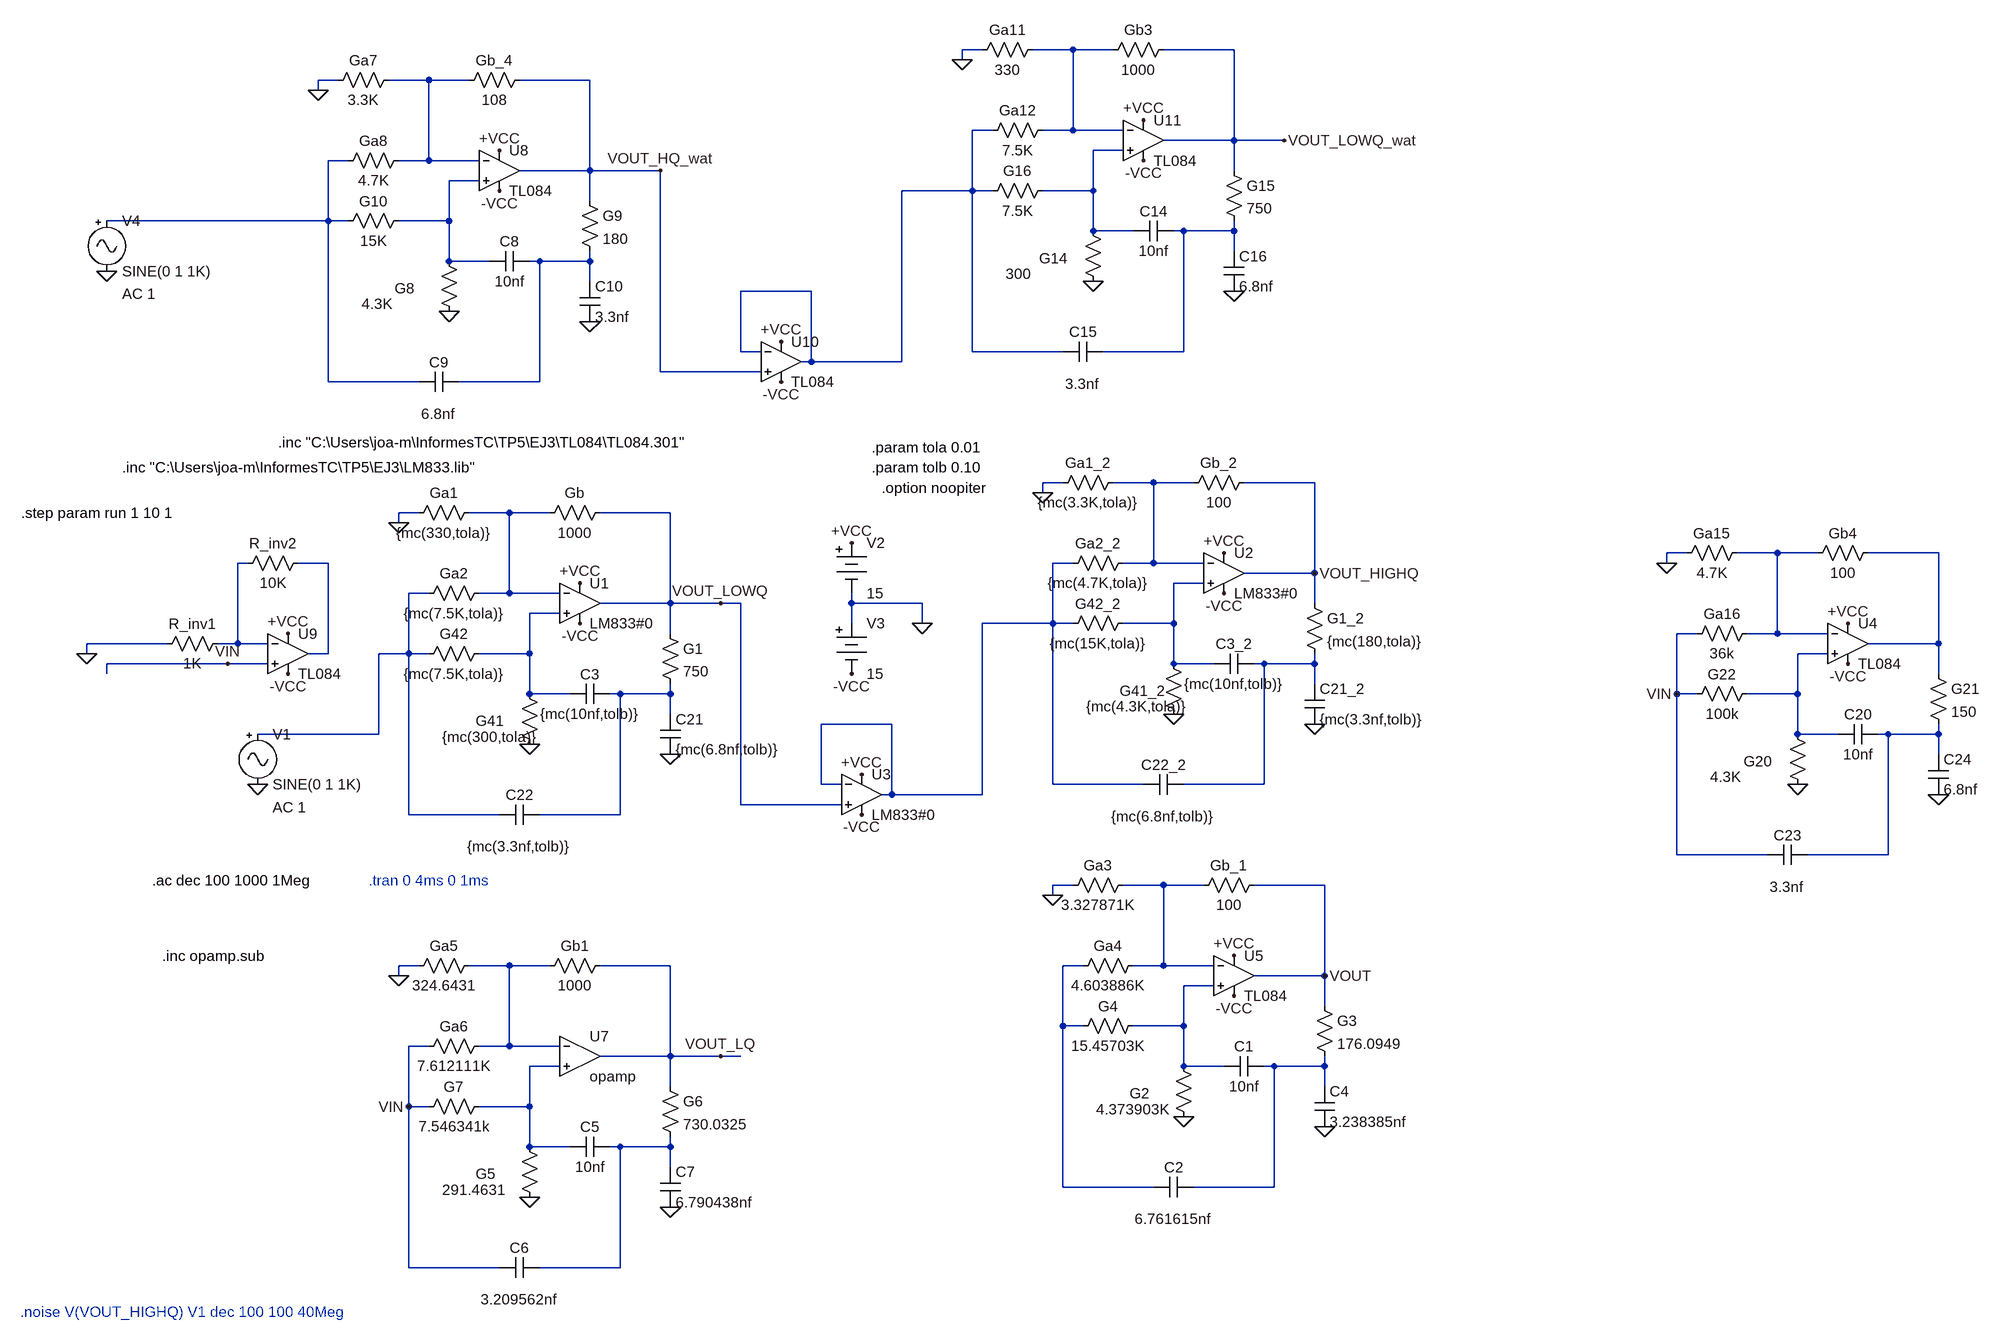
[diagram p0: schematic SedraConPablomenos05.asc]
SedraConPablomenos05.asc, the LTspice schematic file:
Version 4
SHEET 1 3008 2004
WIRE 1040 -736 1008 -736
WIRE 1184 -736 1120 -736
WIRE 1248 -736 1184 -736
WIRE 1440 -736 1328 -736
WIRE 1008 -720 1008 -736
WIRE 16 -688 -16 -688
WIRE 160 -688 96 -688
WIRE 224 -688 160 -688
WIRE 416 -688 304 -688
WIRE -16 -672 -16 -688
WIRE 1056 -608 1024 -608
WIRE 1184 -608 1184 -736
WIRE 1184 -608 1136 -608
WIRE 1264 -608 1184 -608
WIRE 1440 -592 1440 -736
WIRE 1440 -592 1328 -592
WIRE 1520 -592 1440 -592
WIRE 1264 -576 1216 -576
WIRE 32 -560 0 -560
WIRE 160 -560 160 -688
WIRE 160 -560 112 -560
WIRE 240 -560 160 -560
WIRE 416 -544 416 -688
WIRE 416 -544 304 -544
WIRE 528 -544 416 -544
WIRE 1440 -544 1440 -592
WIRE 240 -528 192 -528
WIRE 1024 -512 1024 -608
WIRE 1024 -512 912 -512
WIRE 1056 -512 1024 -512
WIRE 1216 -512 1216 -576
WIRE 1216 -512 1136 -512
WIRE 416 -496 416 -544
WIRE 0 -464 0 -560
WIRE 0 -464 -352 -464
WIRE 32 -464 0 -464
WIRE 192 -464 192 -528
WIRE 192 -464 112 -464
WIRE 1216 -448 1216 -512
WIRE 1280 -448 1216 -448
WIRE 1360 -448 1344 -448
WIRE 1440 -448 1440 -464
WIRE 1440 -448 1360 -448
WIRE 1440 -416 1440 -448
WIRE 192 -400 192 -464
WIRE 256 -400 192 -400
WIRE 336 -400 320 -400
WIRE 416 -400 416 -416
WIRE 416 -400 336 -400
WIRE 416 -368 416 -400
WIRE 768 -352 656 -352
WIRE 656 -256 656 -352
WIRE 688 -256 656 -256
WIRE 1024 -256 1024 -512
WIRE 1168 -256 1024 -256
WIRE 1360 -256 1360 -448
WIRE 1360 -256 1232 -256
WIRE 768 -240 768 -352
WIRE 768 -240 752 -240
WIRE 912 -240 912 -512
WIRE 912 -240 768 -240
WIRE 528 -224 528 -544
WIRE 688 -224 528 -224
WIRE 0 -208 0 -464
WIRE 144 -208 0 -208
WIRE 336 -208 336 -400
WIRE 336 -208 208 -208
WIRE 1168 -48 1136 -48
WIRE 1312 -48 1248 -48
WIRE 1376 -48 1312 -48
WIRE 1568 -48 1456 -48
WIRE 1136 -32 1136 -48
WIRE 144 0 112 0
WIRE 288 0 224 0
WIRE 352 0 288 0
WIRE 544 0 432 0
WIRE 112 16 112 0
WIRE 2160 64 2128 64
WIRE 2304 64 2240 64
WIRE 2368 64 2304 64
WIRE 2560 64 2448 64
WIRE -128 80 -144 80
WIRE 0 80 -48 80
WIRE 1184 80 1152 80
WIRE 1312 80 1312 -48
WIRE 1312 80 1264 80
WIRE 1392 80 1312 80
WIRE 2128 80 2128 64
WIRE 1568 96 1568 -48
WIRE 1568 96 1456 96
WIRE 1392 112 1344 112
WIRE 160 128 128 128
WIRE 288 128 288 0
WIRE 288 128 240 128
WIRE 368 128 288 128
WIRE 544 144 544 0
WIRE 544 144 432 144
WIRE 624 144 544 144
WIRE 656 144 624 144
WIRE 832 144 832 128
WIRE 944 144 832 144
WIRE 1568 144 1568 96
WIRE 368 160 320 160
WIRE 832 176 832 144
WIRE 944 176 944 144
WIRE 1152 176 1152 80
WIRE 1152 176 1040 176
WIRE 1184 176 1152 176
WIRE 1344 176 1344 112
WIRE 1344 176 1264 176
WIRE 544 192 544 144
WIRE 2176 192 2144 192
WIRE 2304 192 2304 64
WIRE 2304 192 2256 192
WIRE 2384 192 2304 192
WIRE -256 208 -384 208
WIRE -144 208 -144 80
WIRE -144 208 -176 208
WIRE -96 208 -144 208
WIRE 2560 208 2560 64
WIRE 2560 208 2448 208
WIRE -384 224 -384 208
WIRE 0 224 0 80
WIRE 0 224 -32 224
WIRE 128 224 128 128
WIRE 128 224 80 224
WIRE 160 224 128 224
WIRE 320 224 320 160
WIRE 320 224 240 224
WIRE 2384 224 2336 224
WIRE -160 240 -352 240
WIRE -96 240 -160 240
WIRE 1344 240 1344 176
WIRE 1408 240 1344 240
WIRE 1488 240 1472 240
WIRE 1568 240 1568 224
WIRE 1568 240 1488 240
WIRE -352 256 -352 240
WIRE 2560 256 2560 208
WIRE 1568 272 1568 240
WIRE 320 288 320 224
WIRE 384 288 320 288
WIRE 464 288 448 288
WIRE 544 288 544 272
WIRE 544 288 464 288
WIRE 2144 288 2144 192
WIRE 2176 288 2144 288
WIRE 2336 288 2336 224
WIRE 2336 288 2256 288
WIRE 544 320 544 288
WIRE 896 336 784 336
WIRE 80 352 80 224
WIRE 80 352 -112 352
WIRE 2336 352 2336 288
WIRE 2400 352 2336 352
WIRE 2480 352 2464 352
WIRE 2560 352 2560 336
WIRE 2560 352 2480 352
WIRE 2560 384 2560 352
WIRE 784 432 784 336
WIRE 816 432 784 432
WIRE 1152 432 1152 176
WIRE 1296 432 1152 432
WIRE 1488 432 1488 240
WIRE 1488 432 1360 432
WIRE 896 448 896 336
WIRE 896 448 880 448
WIRE 1040 448 1040 176
WIRE 1040 448 896 448
WIRE 656 464 656 144
WIRE 816 464 656 464
WIRE 128 480 128 224
WIRE 272 480 128 480
WIRE 464 480 464 288
WIRE 464 480 336 480
WIRE 2144 544 2144 288
WIRE 2288 544 2144 544
WIRE 2480 544 2480 352
WIRE 2480 544 2352 544
WIRE 1184 592 1152 592
WIRE 1328 592 1264 592
WIRE 1392 592 1328 592
WIRE 1584 592 1472 592
WIRE 1152 608 1152 592
WIRE 144 720 112 720
WIRE 288 720 224 720
WIRE 352 720 288 720
WIRE 544 720 432 720
WIRE 1200 720 1168 720
WIRE 1328 720 1328 592
WIRE 1328 720 1280 720
WIRE 1408 720 1328 720
WIRE 112 736 112 720
WIRE 1584 736 1584 592
WIRE 1584 736 1472 736
WIRE 1408 752 1360 752
WIRE 1584 784 1584 736
WIRE 1168 816 1168 720
WIRE 1200 816 1168 816
WIRE 1360 816 1360 752
WIRE 1360 816 1280 816
WIRE 160 848 128 848
WIRE 288 848 288 720
WIRE 288 848 240 848
WIRE 368 848 288 848
WIRE 544 864 544 720
WIRE 544 864 432 864
WIRE 624 864 544 864
WIRE 656 864 624 864
WIRE 368 880 320 880
WIRE 1360 880 1360 816
WIRE 1424 880 1360 880
WIRE 1504 880 1488 880
WIRE 1584 880 1584 864
WIRE 1584 880 1504 880
WIRE 544 912 544 864
WIRE 1584 912 1584 880
WIRE 128 944 128 848
WIRE 160 944 128 944
WIRE 320 944 320 880
WIRE 320 944 240 944
WIRE 320 1008 320 944
WIRE 384 1008 320 1008
WIRE 464 1008 448 1008
WIRE 544 1008 544 992
WIRE 544 1008 464 1008
WIRE 544 1040 544 1008
WIRE 1168 1072 1168 816
WIRE 1312 1072 1168 1072
WIRE 1504 1072 1504 880
WIRE 1504 1072 1376 1072
WIRE 128 1200 128 944
WIRE 272 1200 128 1200
WIRE 464 1200 464 1008
WIRE 464 1200 336 1200
FLAG 112 16 0
FLAG 544 384 0
FLAG 320 368 0
FLAG -112 432 0
FLAG 944 176 0
FLAG 400 112 +VCC
FLAG 832 48 +VCC
FLAG 400 176 -VCC
FLAG 832 256 -VCC
FLAG 1136 -32 0
FLAG 1568 336 0
FLAG 1344 320 0
FLAG 1424 64 +VCC
FLAG 1424 128 -VCC
FLAG 848 416 +VCC
FLAG 848 480 -VCC
FLAG 1568 96 VOUT_HIGHQ
FLAG 2128 80 0
FLAG 2560 448 0
FLAG 2336 432 0
FLAG 2416 176 +VCC
FLAG 2416 240 -VCC
FLAG 2144 288 VIN
FLAG 624 144 VOUT_LOWQ
FLAG 1152 608 0
FLAG 1584 976 0
FLAG 1360 960 0
FLAG 1440 704 +VCC
FLAG 1440 768 -VCC
FLAG 1584 736 VOUT
FLAG 112 736 0
FLAG 544 1104 0
FLAG 320 1088 0
FLAG 624 864 VOUT_LQ
FLAG 128 944 VIN
FLAG -352 -384 0
FLAG 720 -272 +VCC
FLAG 720 -208 -VCC
FLAG 1008 -720 0
FLAG 1440 -352 0
FLAG 1216 -368 0
FLAG 1296 -624 +VCC
FLAG 1296 -560 -VCC
FLAG 1520 -592 VOUT_LOWQ_wat
FLAG -16 -672 0
FLAG 416 -304 0
FLAG 192 -320 0
FLAG 272 -576 +VCC
FLAG 272 -512 -VCC
FLAG 528 -544 VOUT_HQ_wat
FLAG -64 192 +VCC
FLAG -64 256 -VCC
FLAG -384 224 0
FLAG -160 240 VIN
SYMBOL Opamps\\opamp2 400 80 R0
SYMATTR InstName U1
SYMATTR Value LM833#0
SYMATTR SpiceModel LM833#0
SYMBOL res 128 16 R270
WINDOW 0 32 56 VTop 2
WINDOW 3 0 56 VBottom 2
SYMATTR InstName Ga1
SYMATTR Value {mc(330,tola)}
SYMBOL res 336 16 R270
WINDOW 0 32 56 VTop 2
WINDOW 3 0 56 VBottom 2
SYMATTR InstName Gb
SYMATTR Value 1000
SYMBOL res 304 272 R0
WINDOW 0 -70 59 Left 2
WINDOW 3 -123 84 Left 2
SYMATTR InstName G41
SYMATTR Value {mc(300,tola)}
SYMBOL res 528 176 R0
SYMATTR InstName G1
SYMATTR Value 750
SYMBOL cap 448 272 R90
WINDOW 0 0 32 VBottom 2
WINDOW 3 32 32 VTop 2
SYMATTR InstName C3
SYMATTR Value {mc(10nf,tolb)}
SYMBOL cap 336 464 R90
WINDOW 0 0 32 VBottom 2
WINDOW 3 51 33 VTop 2
SYMATTR InstName C22
SYMATTR Value {mc(3.3nf,tolb)}
SYMBOL cap 528 320 R0
SYMATTR InstName C21
SYMATTR Value {mc(6.8nf,tolb)}
SYMBOL Misc\\signal -112 336 R0
WINDOW 123 24 132 Left 2
WINDOW 39 0 0 Left 0
SYMATTR Value2 AC 1
SYMATTR InstName V1
SYMBOL Misc\\battery 832 32 R0
WINDOW 123 0 0 Left 0
WINDOW 39 0 0 Left 0
SYMATTR InstName V2
SYMATTR Value 15
SYMBOL Misc\\battery 832 160 R0
WINDOW 123 0 0 Left 0
WINDOW 39 0 0 Left 0
SYMATTR InstName V3
SYMATTR Value 15
SYMBOL res 256 112 R90
WINDOW 0 0 56 VBottom 2
WINDOW 3 32 56 VTop 2
SYMATTR InstName Ga2
SYMATTR Value {mc(7.5K,tola)}
SYMBOL res 256 208 R90
WINDOW 0 0 56 VBottom 2
WINDOW 3 32 56 VTop 2
SYMATTR InstName G42
SYMATTR Value {mc(7.5K,tola)}
SYMBOL Opamps\\opamp2 1424 32 R0
SYMATTR InstName U2
SYMATTR Value LM833#0
SYMATTR SpiceModel LM833#0
SYMBOL res 1152 -32 R270
WINDOW 0 32 56 VTop 2
WINDOW 3 0 56 VBottom 2
SYMATTR InstName Ga1_2
SYMATTR Value {mc(3.3K,tola)}
SYMBOL res 1360 -32 R270
WINDOW 0 32 56 VTop 2
WINDOW 3 0 56 VBottom 2
SYMATTR InstName Gb_2
SYMATTR Value 100
SYMBOL res 1328 224 R0
WINDOW 0 -70 59 Left 2
WINDOW 3 -123 84 Left 2
SYMATTR InstName G41_2
SYMATTR Value {mc(4.3K,tola)}
SYMBOL res 1552 128 R0
SYMATTR InstName G1_2
SYMATTR Value {mc(180,tola)}
SYMBOL cap 1472 224 R90
WINDOW 0 0 32 VBottom 2
WINDOW 3 32 32 VTop 2
SYMATTR InstName C3_2
SYMATTR Value {mc(10nf,tolb)}
SYMBOL cap 1360 416 R90
WINDOW 0 0 32 VBottom 2
WINDOW 3 51 33 VTop 2
SYMATTR InstName C22_2
SYMATTR Value {mc(6.8nf,tolb)}
SYMBOL cap 1552 272 R0
SYMATTR InstName C21_2
SYMATTR Value {mc(3.3nf,tolb)}
SYMBOL res 1280 64 R90
WINDOW 0 0 56 VBottom 2
WINDOW 3 32 56 VTop 2
SYMATTR InstName Ga2_2
SYMATTR Value {mc(4.7K,tola)}
SYMBOL res 1280 160 R90
WINDOW 0 0 56 VBottom 2
WINDOW 3 32 56 VTop 2
SYMATTR InstName G42_2
SYMATTR Value {mc(15K,tola)}
SYMBOL Opamps\\opamp2 848 384 R0
SYMATTR InstName U3
SYMATTR Value LM833#0
SYMATTR SpiceModel LM833#0
SYMBOL Opamps\\opamp2 2416 144 R0
SYMATTR InstName U4
SYMATTR Value TL084
SYMATTR SpiceModel TL084
SYMBOL res 2144 80 R270
WINDOW 0 32 56 VTop 2
WINDOW 3 0 56 VBottom 2
SYMATTR InstName Ga15
SYMATTR Value 4.7K
SYMBOL res 2352 80 R270
WINDOW 0 32 56 VTop 2
WINDOW 3 0 56 VBottom 2
SYMATTR InstName Gb4
SYMATTR Value 100
SYMBOL res 2320 336 R0
WINDOW 0 -70 59 Left 2
WINDOW 3 -123 84 Left 2
SYMATTR InstName G20
SYMATTR Value 4.3K
SYMBOL res 2544 240 R0
SYMATTR InstName G21
SYMATTR Value 150
SYMBOL cap 2464 336 R90
WINDOW 0 0 32 VBottom 2
WINDOW 3 32 32 VTop 2
SYMATTR InstName C20
SYMATTR Value 10nf
SYMBOL cap 2352 528 R90
WINDOW 0 0 32 VBottom 2
WINDOW 3 51 33 VTop 2
SYMATTR InstName C23
SYMATTR Value 3.3nf
SYMBOL cap 2544 384 R0
SYMATTR InstName C24
SYMATTR Value 6.8nf
SYMBOL res 2272 176 R90
WINDOW 0 0 56 VBottom 2
WINDOW 3 32 56 VTop 2
SYMATTR InstName Ga16
SYMATTR Value 36k
SYMBOL res 2272 272 R90
WINDOW 0 0 56 VBottom 2
WINDOW 3 32 56 VTop 2
SYMATTR InstName G22
SYMATTR Value 100k
SYMBOL Opamps\\opamp2 1440 672 R0
SYMATTR InstName U5
SYMATTR Value TL084
SYMATTR SpiceModel TL084
SYMBOL res 1168 608 R270
WINDOW 0 32 56 VTop 2
WINDOW 3 0 56 VBottom 2
SYMATTR InstName Ga3
SYMATTR Value 3.327871K
SYMBOL res 1376 608 R270
WINDOW 0 32 56 VTop 2
WINDOW 3 0 56 VBottom 2
SYMATTR InstName Gb_1
SYMATTR Value 100
SYMBOL res 1344 864 R0
WINDOW 0 -70 59 Left 2
WINDOW 3 -123 84 Left 2
SYMATTR InstName G2
SYMATTR Value 4.373903K
SYMBOL res 1568 768 R0
SYMATTR InstName G3
SYMATTR Value 176.0949
SYMBOL cap 1488 864 R90
WINDOW 0 0 32 VBottom 2
WINDOW 3 32 32 VTop 2
SYMATTR InstName C1
SYMATTR Value 10nf
SYMBOL cap 1376 1056 R90
WINDOW 0 0 32 VBottom 2
WINDOW 3 51 33 VTop 2
SYMATTR InstName C2
SYMATTR Value 6.761615nf
SYMBOL cap 1568 912 R0
SYMATTR InstName C4
SYMATTR Value 3.238385nf
SYMBOL res 1296 704 R90
WINDOW 0 0 56 VBottom 2
WINDOW 3 32 56 VTop 2
SYMATTR InstName Ga4
SYMATTR Value 4.603886K
SYMBOL res 1296 800 R90
WINDOW 0 0 56 VBottom 2
WINDOW 3 32 56 VTop 2
SYMATTR InstName G4
SYMATTR Value 15.45703K
SYMBOL res 128 736 R270
WINDOW 0 32 56 VTop 2
WINDOW 3 0 56 VBottom 2
SYMATTR InstName Ga5
SYMATTR Value 324.6431
SYMBOL res 336 736 R270
WINDOW 0 32 56 VTop 2
WINDOW 3 0 56 VBottom 2
SYMATTR InstName Gb1
SYMATTR Value 1000
SYMBOL res 304 992 R0
WINDOW 0 -70 59 Left 2
WINDOW 3 -123 84 Left 2
SYMATTR InstName G5
SYMATTR Value 291.4631
SYMBOL res 528 896 R0
SYMATTR InstName G6
SYMATTR Value 730.0325
SYMBOL cap 448 992 R90
WINDOW 0 0 32 VBottom 2
WINDOW 3 32 32 VTop 2
SYMATTR InstName C5
SYMATTR Value 10nf
SYMBOL cap 336 1184 R90
WINDOW 0 0 32 VBottom 2
WINDOW 3 51 33 VTop 2
SYMATTR InstName C6
SYMATTR Value 3.209562nf
SYMBOL cap 528 1040 R0
SYMATTR InstName C7
SYMATTR Value 6.790438nf
SYMBOL res 256 832 R90
WINDOW 0 0 56 VBottom 2
WINDOW 3 32 56 VTop 2
SYMATTR InstName Ga6
SYMATTR Value 7.612111K
SYMBOL res 256 928 R90
WINDOW 0 0 56 VBottom 2
WINDOW 3 32 56 VTop 2
SYMATTR InstName G7
SYMATTR Value 7.546341k
SYMBOL Opamps\\opamp 400 800 R0
SYMATTR InstName U7
SYMATTR SpiceLine Aol=1000000K
SYMATTR SpiceLine2 GBW=10000000Meg
SYMBOL Misc\\signal -352 -480 R0
WINDOW 123 24 132 Left 2
WINDOW 39 0 0 Left 0
SYMATTR Value2 AC 1
SYMATTR InstName V4
SYMBOL Opamps\\opamp2 720 -304 R0
SYMATTR InstName U10
SYMATTR Value TL084
SYMATTR SpiceModel TL084
SYMBOL Opamps\\opamp2 1296 -656 R0
SYMATTR InstName U11
SYMATTR Value TL084
SYMATTR SpiceModel TL084
SYMBOL res 1024 -720 R270
WINDOW 0 32 56 VTop 2
WINDOW 3 0 56 VBottom 2
SYMATTR InstName Ga11
SYMATTR Value 330
SYMBOL res 1232 -720 R270
WINDOW 0 32 56 VTop 2
WINDOW 3 0 56 VBottom 2
SYMATTR InstName Gb3
SYMATTR Value 1000
SYMBOL res 1200 -464 R0
WINDOW 0 -70 59 Left 2
WINDOW 3 -123 84 Left 2
SYMATTR InstName G14
SYMATTR Value 300
SYMBOL res 1424 -560 R0
SYMATTR InstName G15
SYMATTR Value 750
SYMBOL cap 1344 -464 R90
WINDOW 0 0 32 VBottom 2
WINDOW 3 32 32 VTop 2
SYMATTR InstName C14
SYMATTR Value 10nf
SYMBOL cap 1232 -272 R90
WINDOW 0 0 32 VBottom 2
WINDOW 3 51 33 VTop 2
SYMATTR InstName C15
SYMATTR Value 3.3nf
SYMBOL cap 1424 -416 R0
SYMATTR InstName C16
SYMATTR Value 6.8nf
SYMBOL res 1152 -624 R90
WINDOW 0 0 56 VBottom 2
WINDOW 3 32 56 VTop 2
SYMATTR InstName Ga12
SYMATTR Value 7.5K
SYMBOL res 1152 -528 R90
WINDOW 0 0 56 VBottom 2
WINDOW 3 32 56 VTop 2
SYMATTR InstName G16
SYMATTR Value 7.5K
SYMBOL Opamps\\opamp2 272 -608 R0
SYMATTR InstName U8
SYMATTR Value TL084
SYMATTR SpiceModel TL084
SYMBOL res 0 -672 R270
WINDOW 0 32 56 VTop 2
WINDOW 3 0 56 VBottom 2
SYMATTR InstName Ga7
SYMATTR Value 3.3K
SYMBOL res 208 -672 R270
WINDOW 0 32 56 VTop 2
WINDOW 3 0 56 VBottom 2
SYMATTR InstName Gb_4
SYMATTR Value 108
SYMBOL res 176 -416 R0
WINDOW 0 -70 59 Left 2
WINDOW 3 -123 84 Left 2
SYMATTR InstName G8
SYMATTR Value 4.3K
SYMBOL res 400 -512 R0
SYMATTR InstName G9
SYMATTR Value 180
SYMBOL cap 320 -416 R90
WINDOW 0 0 32 VBottom 2
WINDOW 3 32 32 VTop 2
SYMATTR InstName C8
SYMATTR Value 10nf
SYMBOL cap 208 -224 R90
WINDOW 0 0 32 VBottom 2
WINDOW 3 51 33 VTop 2
SYMATTR InstName C9
SYMATTR Value 6.8nf
SYMBOL cap 400 -368 R0
SYMATTR InstName C10
SYMATTR Value 3.3nf
SYMBOL res 128 -576 R90
WINDOW 0 0 56 VBottom 2
WINDOW 3 32 56 VTop 2
SYMATTR InstName Ga8
SYMATTR Value 4.7K
SYMBOL res 128 -480 R90
WINDOW 0 0 56 VBottom 2
WINDOW 3 32 56 VTop 2
SYMATTR InstName G10
SYMATTR Value 15K
SYMBOL Opamps\\opamp2 -64 160 R0
SYMATTR InstName U9
SYMATTR Value TL084
SYMATTR Value2 TL084
SYMBOL res -160 192 R90
WINDOW 0 0 56 VBottom 2
WINDOW 3 32 56 VTop 2
SYMATTR InstName R_inv1
SYMATTR Value 1K
SYMBOL res -32 64 R90
WINDOW 0 0 56 VBottom 2
WINDOW 3 32 56 VTop 2
SYMATTR InstName R_inv2
SYMATTR Value 10K
TEXT -80 -112 Left 2 !.inc "C:\\Users\\joa-m\\InformesTC\\TP5\\EJ3\\TL084\\TL084.301"
TEXT 64 584 Left 2 ;.tran 0 4ms 0 1ms
TEXT -264 704 Left 2 !.inc opamp.sub
TEXT -328 -72 Left 2 !.inc "C:\\Users\\joa-m\\InformesTC\\TP5\\EJ3\\LM833.lib"
TEXT 864 -104 Left 2 !.param tola 0.01
TEXT 864 -72 Left 2 !.param tolb 0.10
TEXT -488 0 Left 2 !.step param run 1 10 1
TEXT 880 -40 Left 2 !.option noopiter
TEXT -280 584 Left 2 !.ac dec 100 1000 1Meg
TEXT -490 1270 Left 2 ;.noise V(VOUT_HIGHQ) V1 dec 100 100 40Meg

The netlist it stands for:
* SedraConPablomenos05.asc
XU1 N018 N010 +VCC -VCC VOUT_LOWQ LM833#0 LM833#0  ; pins In+ In- V+ V- OUT
R§Ga1 0 N010 {mc(330,tola)}
R§Gb N010 VOUT_LOWQ 1000
R§G41 N018 0 {mc(300,tola)}
R§G1 VOUT_LOWQ N021 750
C3 N021 N018 {mc(10nf,tolb)}
C22 N021 N017 {mc(3.3nf,tolb)}
C21 N021 0 {mc(6.8nf,tolb)}
V1 N017 0 SINE(0 1 1K) AC 1
V2 +VCC 0 15
V3 0 -VCC 15
R§Ga2 N010 N017 {mc(7.5K,tola)}
R§G42 N018 N017 {mc(7.5K,tola)}
XU2 N016 N009 +VCC -VCC VOUT_HIGHQ LM833#0 LM833#0  ; pins In+ In- V+ V- OUT
R§Ga1_2 0 N009 {mc(3.3K,tola)}
R§Gb_2 N009 VOUT_HIGHQ 100
R§G41_2 N016 0 {mc(4.3K,tola)}
R§G1_2 VOUT_HIGHQ N020 {mc(180,tola)}
C3_2 N020 N016 {mc(10nf,tolb)}
C22_2 N020 N015 {mc(6.8nf,tolb)}
C21_2 N020 0 {mc(3.3nf,tolb)}
R§Ga2_2 N009 N015 {mc(4.7K,tola)}
R§G42_2 N016 N015 {mc(15K,tola)}
XU3 VOUT_LOWQ N015 +VCC -VCC N015 LM833#0 LM833#0  ; pins In+ In- V+ V- OUT
XU4 N019 N011 +VCC -VCC N012 TL084 TL084  ; pins In+ In- V+ V- OUT
R§Ga15 0 N011 4.7K
R§Gb4 N011 N012 100
R§G20 N019 0 4.3K
R§G21 N012 N022 150
C20 N022 N019 10nf
C23 N022 VIN 3.3nf
C24 N022 0 6.8nf
R§Ga16 N011 VIN 36k
R§G22 N019 VIN 100k
XU5 N026 N023 +VCC -VCC VOUT TL084 TL084  ; pins In+ In- V+ V- OUT
R§Ga3 0 N023 3.327871K
R§Gb_1 N023 VOUT 100
R§G2 N026 0 4.373903K
R§G3 VOUT N028 176.0949
C1 N028 N026 10nf
C2 N028 N025 6.761615nf
C4 N028 0 3.238385nf
R§Ga4 N023 N025 4.603886K
R§G4 N026 N025 15.45703K
R§Ga5 0 N024 324.6431
R§Gb1 N024 VOUT_LQ 1000
R§G5 N027 0 291.4631
R§G6 VOUT_LQ N029 730.0325
C5 N029 N027 10nf
C6 N029 VIN 3.209562nf
C7 N029 0 6.790438nf
R§Ga6 N024 VIN 7.612111K
R§G7 N027 VIN 7.546341k
XU7 N024 N027 VOUT_LQ opamp Aol=1000000K GBW=10000000Meg  ; pins invin noninvin out
V4 N005 0 SINE(0 1 1K) AC 1
XU10 VOUT_HQ_wat N003 +VCC -VCC N003 TL084 TL084  ; pins In+ In- V+ V- OUT
XU11 N004 N001 +VCC -VCC VOUT_LOWQ_wat TL084 TL084  ; pins In+ In- V+ V- OUT
R§Ga11 0 N001 330
R§Gb3 N001 VOUT_LOWQ_wat 1000
R§G14 N004 0 300
R§G15 VOUT_LOWQ_wat N007 750
C14 N007 N004 10nf
C15 N007 N003 3.3nf
C16 N007 0 6.8nf
R§Ga12 N001 N003 7.5K
R§G16 N004 N003 7.5K
XU8 N006 N002 +VCC -VCC VOUT_HQ_wat TL084 TL084  ; pins In+ In- V+ V- OUT
R§Ga7 0 N002 3.3K
R§Gb_4 N002 VOUT_HQ_wat 108
R§G8 N006 0 4.3K
R§G9 VOUT_HQ_wat N008 180
C8 N008 N006 10nf
C9 N008 N005 6.8nf
C10 N008 0 3.3nf
R§Ga8 N002 N005 4.7K
R§G10 N006 N005 15K
XU9 VIN N013 +VCC -VCC N014 TL084 TL084  ; pins In+ In- V+ V- OUT
R_inv1 N013 0 1K
R_inv2 N014 N013 10K
.inc "C:\Users\joa-m\InformesTC\TP5\EJ3\TL084\TL084.301"
* .tran 0 4ms 0 1ms
.inc opamp.sub
.inc "C:\Users\joa-m\InformesTC\TP5\EJ3\LM833.lib"
.param tola 0.01
.param tolb 0.10
.step param run 1 10 1
.option noopiter
.ac dec 100 1000 1Meg
* .noise V(VOUT_HIGHQ) V1 dec 100 100 40Meg
.backanno
.end